# EAGLE design BandpassedGainAmpThruhole (EAGLE 9.5.1)
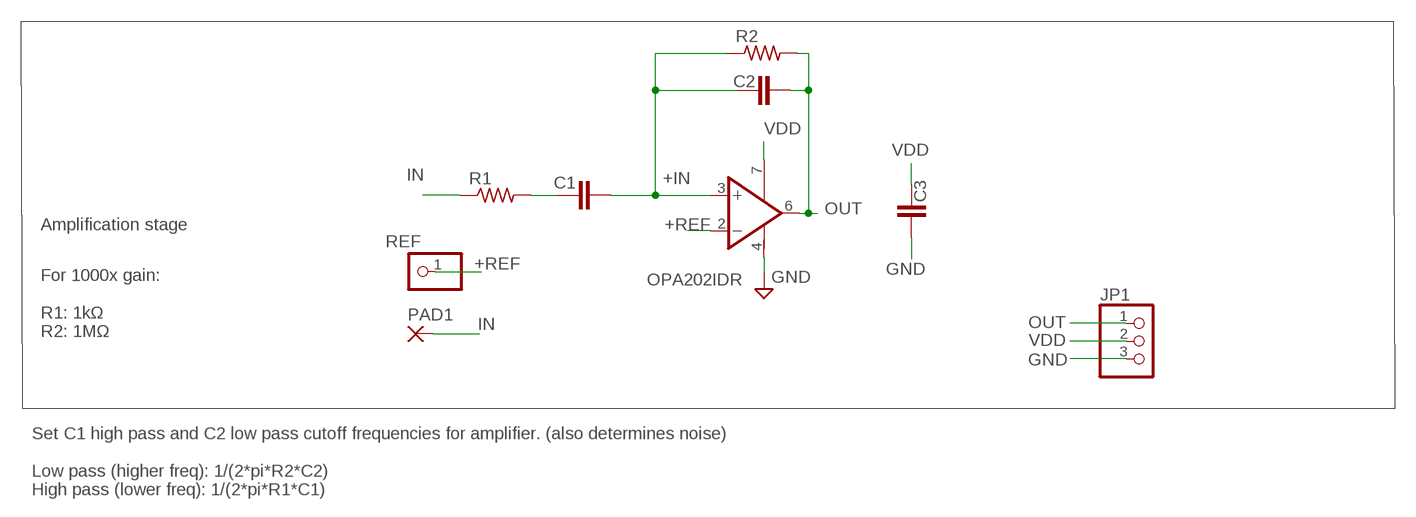
[diagram p0: schematic, sheet 1]

## Parts
C1  C2.5/2  [C2.5-2]
C2  C2.5/2  [C2.5-2]
C3  C2.5/2  [C2.5-2]
JP1  PINHD-1X3  [1X03]
PAD1  3,17/1,1  [3,17/1,1]
R1  R-US_0204/5  [0204/5]
R2  R-US_0204/5  [0204/5]
REF  PINHD-1X1  [1X01]
U1  OPA202IDR  [SOIC127P600X175-8N]

## Nets
+IN: C1.2 C2.1 R2.1 U1.3(A:+IN)
+REF: REF.1 U1.2(A:-IN)
GND: C3.2 JP1.3 U1.4(SUPP:V-)
IN: PAD1.1(P) R1.1
OUT: C2.2 JP1.1 R2.2 U1.6(A:OUT)
R1C1: C1.1 R1.2
VDD: C3.1 JP1.2 U1.7(SUPP:V+)

## Notes on the sheet
- Amplification stage
- For 1000x gain:
  
  R1: 1kΩ
  R2: 1MΩ
- Set C1 high pass and C2 low pass cutoff frequencies for amplifier. (also determines noise)
  
  Low pass (higher freq): 1/(2*pi*R2*C2)
  High pass (lower freq): 1/(2*pi*R1*C1)

## Library data of the parts
C1-C3 = capacitor-wima:C: CAPACITOR naming: grid - package width
JP1 = pinhead:PINHD-1X3: PIN HEADER
PAD1 = wirepad:3,17/1,1: THROUGH-HOLE PAD
R1 R2 = rcl:R-US_: RESISTOR, American symbol; SPICEPREFIX: R
REF = pinhead:PINHD-1X1: PIN HEADER
U1 = OPA202IDR:OPA202IDR: OPAx202 Precision, Low-Noise, Heavy Capacitive Drive, 36-V Operational Amplifiers Source: Datasheet <https://www.ti.com/lit/ds/symlink/opa202.pdf?HQS=dis-dk-null-digikeymode-dsf-pf-null-wwe&ts=1654259980940&ref_url=https%253A%252F%252Fwww.ti.com%252Fgeneral%252Fdocs%252Fsuppproductinfo.tsp%253FdistId%253D10%2526gotoUrl%253Dhttps%253A%252F%252Fwww.ti.com%252Flit%252Fgpn%252Fopa202> Check availability <https://pricing.snapeda.com/parts/OPA202IDR/Texas%20Instruments/view-part?ref=eda>; AVAILABILITY: In Stock; CHECK_PRICES: https://www.snapeda.com/parts/OPA202IDR/Texas+Instruments/view-part/?ref=eda; DESCRIPTION: Low-noise (0.2 µVPP, 9 nV/√Hz) heavy-capacitive-drive (25 nF) super-beta precision op amp; MF: Texas Instruments; MP: OPA202IDR; PACKAGE: SOIC-8 Texas Instruments; PRICE: None; PURCHASE-URL: https://www.snapeda.com/api/url_track_click_mouser/?unipart_id=4806048&manufacturer=Texas Instruments&part_name=OPA202IDR&search_term=opa202; SNAPEDA_LINK: https://www.snapeda.com/parts/OPA202IDR/Texas+Instruments/view-part/?ref=snap

## Board
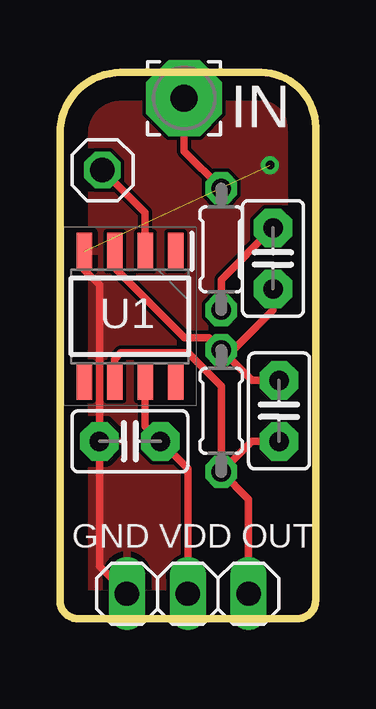
[diagram p1: board, top side]
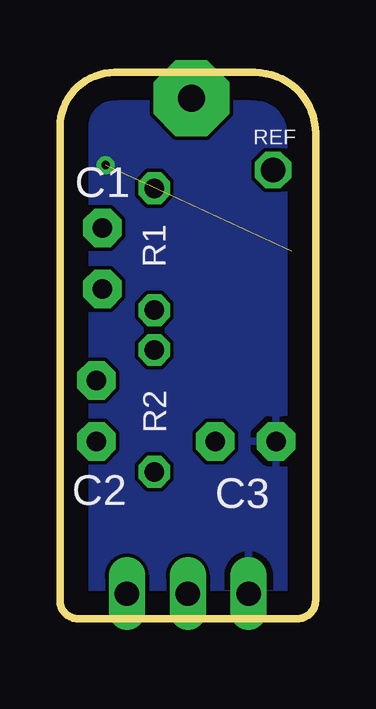
[diagram p2: board, bottom side, seen from below]

Size 10.67 x 22.76 mm. Coordinates in mm from the lower left corner, seen from the top.
Outline: 9.91,0 0.76,0 arc-90 0,0.76 0,20.22 arc-90 2.54,22.76 8.38,22.76 arc-90 10.67,20.47 10.67,0.76 arc-90 9.91,0
Copper layers (1*16): Top 0.035mm / dielectric 1.5mm / Bottom 0.035mm
Design rules "default": minimum track width 6mil, minimum drill 0.35mm, track to track 6mil, track to pad 6mil, pad to pad 6mil, via to via 6mil, smd to smd 6mil, copper to edge 40mil, drill to drill 6mil, minimum pad ring 10mil, minimum via ring 8mil, stop-mask expansion 4mil, vias tented up to drill 0mil, thermal gap 10mil

### Footprints (pad centres in the part's own frame; a part is rotated, then mirrored left to right if it is on the bottom)
C2.5-2 = drill 0.813 pad 1.6 octagon: 1 -1.27,0; 2 1.27,0
1X03 = drill 1.016 long: 1 -2.54,0; 2 0,0; 3 2.54,0
3,17/1,1 = drill 1.118 pad 3.175 octagon: 1 0,0
0204/5 = drill 0.813 octagon: 1 -2.54,0; 2 2.54,0
1X01 = drill 1.016 octagon: 1 0,0
SOIC127P600X175-8N = smd 1.528 x 0.65: 1 -2.711,1.905; 2 -2.711,0.635; 3 -2.711,-0.635; 4 -2.711,-1.905; 5 2.711,-1.905; 6 2.711,-0.635; 7 2.711,0.635; 8 2.711,1.905

### Placement (x,y rotation side)
C1  8.89,15.01 270 top
C2  9.14,8.66 270 top
C3  2.92,7.39 180 top
JP1  5.33,1.04 180 top
PAD1  5.18,21.69 0 top
R1  6.73,15.39 270 top
R2  6.73,8.66 270 top
REF  1.78,18.69 0 top
U1  2.92,12.6 270 top

### Tracks (layer width: path | path; a pad name or v marks a point on that pad's centre or on a via)
+IN
  Top 0.305: C1.2 8.89,12.85 7.24,11.2 R2.1 | C2.1 8,9.93 R2.1 | U1.3 2.29,14.63 5.21,11.71 6.22,11.71 R2.1
+REF
  Top 0.305: U1.2 3.56,16.92 REF.1
GND  (via drill 0.35)  (1 unrouted)
  Top 0.305: U1.4 1.02,14.55 1.65,13.91 C3.2 1.65,2.18 JP1.3
  other vias: 8.76,18.9
  pour Top: -0.89,-0.64 11.43,-0.64 11.43,25.15 -0.89,25.15
  pour Bottom: -0.64,-0.51 -0.64,25.02 11.05,25.02 11.05,-0.51
IN
  Top 0.305: PAD1.1 5.18,19.48 R1.1
OUT
  Top 0.305: R2.2 8,7.39 C2.2 | U1.6 2.29,10.82 2.54,11.07 5.33,11.07 6.73,9.68 R2.2 | R2.2 7.87,4.98 JP1.1
R1C1
  Top 0.305: R1.2 6.73,14.12 C1.1
VDD
  Top 0.305: 3.56,9.42 U1.7 3.56,8.03 C3.1 5.33,6.25 JP1.2

### Text on the board
tNames: IN | GND VDD OUT